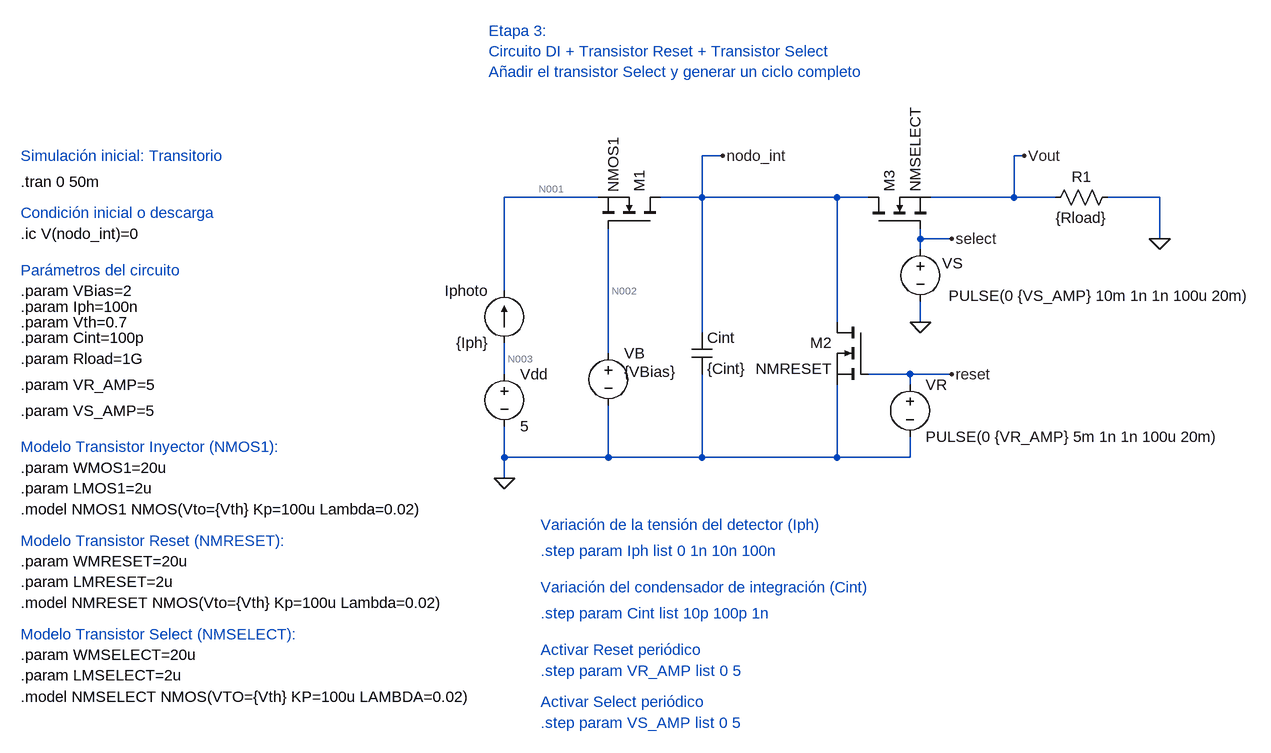
[diagram p0: schematic ID_Etapa3_Select_NMOS.asc]
ID_Etapa3_Select_NMOS.asc, the LTspice schematic file:
Version 4.1
SHEET 1 1592 1016
WIRE -96 0 -128 0
WIRE 368 0 352 0
WIRE -288 64 -432 64
WIRE -128 64 -128 0
WIRE -128 64 -192 64
WIRE 80 64 -128 64
WIRE 128 64 80 64
WIRE 352 64 352 0
WIRE 352 64 224 64
WIRE 416 64 352 64
WIRE 576 64 496 64
WIRE 208 128 208 112
WIRE 256 128 208 128
WIRE 576 128 576 64
WIRE 208 144 208 128
WIRE -432 208 -432 64
WIRE 80 256 80 64
WIRE 208 256 208 224
WIRE -128 272 -128 64
WIRE -272 304 -272 112
WIRE -432 336 -432 288
WIRE 192 336 128 336
WIRE 256 336 192 336
WIRE 192 352 192 336
WIRE -432 464 -432 416
WIRE -272 464 -272 384
WIRE -272 464 -432 464
WIRE -128 464 -128 336
WIRE -128 464 -272 464
WIRE 80 464 80 352
WIRE 80 464 -128 464
WIRE 192 464 192 432
WIRE 192 464 80 464
WIRE -432 496 -432 464
FLAG -96 0 nodo_int
FLAG -432 496 0
FLAG 256 336 reset
FLAG 368 0 Vout
FLAG 256 128 select
FLAG 576 128 0
FLAG 208 256 0
SYMBOL current -432 288 R180
WINDOW 0 24 80 Left 2
WINDOW 3 24 0 Left 2
SYMATTR InstName Iphoto
SYMATTR Value {Iph}
SYMBOL nmos -192 112 M270
SYMATTR InstName M1
SYMATTR Value NMOS1
SYMATTR SpiceLine W={WMOS1} L={LMOS1}
SYMBOL cap -144 272 R0
SYMATTR InstName Cint
SYMATTR Value {Cint}
SYMBOL voltage -272 288 R0
WINDOW 3 24 44 Left 2
SYMATTR Value {VBias}
SYMATTR InstName VB
SYMBOL voltage -432 320 R0
WINDOW 123 0 0 Left 0
WINDOW 39 0 0 Left 0
SYMATTR InstName Vdd
SYMATTR Value 5
SYMBOL voltage 192 336 R0
WINDOW 123 0 0 Left 0
WINDOW 39 0 0 Left 0
SYMATTR InstName VR
SYMATTR Value PULSE(0 {VR_AMP} 5m 1n 1n 100u 20m)
SYMBOL nmos 128 256 M0
SYMATTR InstName M2
SYMATTR Value NMRESET
SYMATTR SpiceLine W={WMRESET} L={LMRESET}
SYMBOL nmos 128 112 R270
SYMATTR InstName M3
SYMATTR Value NMSELECT
SYMATTR SpiceLine W={WMSELECT} L={LMSELECT}
SYMBOL voltage 208 128 R0
WINDOW 0 49 22 Top 2
WINDOW 3 276 103 Bottom 2
WINDOW 123 0 0 Left 0
WINDOW 39 0 0 Left 0
SYMATTR InstName VS
SYMATTR Value PULSE(0 {VS_AMP} 10m 1n 1n 100u 20m)
SYMBOL res 400 80 R270
WINDOW 0 32 56 VTop 2
WINDOW 3 0 56 VBottom 2
SYMATTR InstName R1
SYMATTR Value {Rload}
TEXT -456 -192 Left 2 ;Etapa 3: \nCircuito DI + Transistor Reset + Transistor Select\nAñadir el transistor Select y generar un ciclo completo
TEXT -1176 544 Left 2 !.model NMOS1 NMOS(Vto={Vth} Kp=100u Lambda=0.02)
TEXT -1176 480 Left 2 !.param WMOS1=20u\n.param LMOS1=2u
TEXT -1176 448 Left 2 ;Modelo Transistor Inyector (NMOS1):
TEXT -1176 0 Left 2 ;Simulación inicial: Transitorio
TEXT -1176 120 Left 2 !.ic V(nodo_int)=0
TEXT -1176 88 Left 2 ;Condición inicial o descarga
TEXT -1176 208 Left 2 !.param VBias=2
TEXT -1176 232 Left 2 !.param Iph=100n
TEXT -1176 256 Left 2 !.param Vth=0.7
TEXT -1176 176 Left 2 ;Parámetros del circuito
TEXT -376 568 Left 2 ;Variación de la tensión del detector (Iph)
TEXT -376 608 Left 2 ;.step param Iph list 0 1n 10n 100n
TEXT -1176 280 Left 2 !.param Cint=100p
TEXT -1176 40 Left 2 !.tran 0 50m
TEXT -1176 592 Left 2 ;Modelo Transistor Reset (NMRESET):
TEXT -1176 624 Left 2 !.param WMRESET=20u\n.param LMRESET=2u
TEXT -1176 688 Left 2 !.model NMRESET NMOS(Vto={Vth} Kp=100u Lambda=0.02)
TEXT -376 664 Left 2 ;Variación del condensador de integración (Cint)
TEXT -376 704 Left 2 ;.step param Cint list 10p 100p 1n
TEXT -1176 352 Left 2 !.param VR_AMP=5
TEXT -376 792 Left 2 ;.step param VR_AMP list 0 5
TEXT -376 760 Left 2 ;Activar Reset periódico
TEXT -1176 832 Left 2 !.model NMSELECT NMOS(VTO={Vth} KP=100u LAMBDA=0.02)
TEXT -1176 736 Left 2 ;Modelo Transistor Select (NMSELECT):
TEXT -1176 768 Left 2 !.param WMSELECT=20u\n.param LMSELECT=2u
TEXT -1176 312 Left 2 !.param Rload=1G
TEXT -1176 392 Left 2 !.param VS_AMP=5
TEXT -376 840 Left 2 ;Activar Select periódico
TEXT -376 872 Left 2 ;.step param VS_AMP list 0 5

The netlist it stands for:
* ID_Etapa3_Select_NMOS.asc
Iphoto N003 N001 {Iph}
M1 nodo_int N002 N001 N001 NMOS1 W={WMOS1} L={LMOS1}
Cint nodo_int 0 {Cint}
VB N002 0 {VBias}
Vdd N003 0 5
VR reset 0 PULSE(0 {VR_AMP} 5m 1n 1n 100u 20m)
M2 nodo_int reset 0 0 NMRESET W={WMRESET} L={LMRESET}
M3 nodo_int select Vout Vout NMSELECT W={WMSELECT} L={LMSELECT}
VS select 0 PULSE(0 {VS_AMP} 10m 1n 1n 100u 20m)
R1 Vout 0 {Rload}
.model NMOS NMOS
.model PMOS PMOS
.lib standard.mos
* Etapa 3:
* Circuito DI + Transistor Reset + Transistor Select
* Añadir el transistor Select y generar un ciclo completo
.model NMOS1 NMOS(Vto={Vth} Kp=100u Lambda=0.02)
.param WMOS1=20u
.param LMOS1=2u
* Modelo Transistor Inyector (NMOS1):
* Simulación inicial: Transitorio
.ic V(nodo_int)=0
* Condición inicial o descarga
.param VBias=2
.param Iph=100n
.param Vth=0.7
* Parámetros del circuito
* Variación de la tensión del detector (Iph)
* .step param Iph list 0 1n 10n 100n
.param Cint=100p
.tran 0 50m
* Modelo Transistor Reset (NMRESET):
.param WMRESET=20u
.param LMRESET=2u
.model NMRESET NMOS(Vto={Vth} Kp=100u Lambda=0.02)
* Variación del condensador de integración (Cint)
* .step param Cint list 10p 100p 1n
.param VR_AMP=5
* .step param VR_AMP list 0 5
* Activar Reset periódico
.model NMSELECT NMOS(VTO={Vth} KP=100u LAMBDA=0.02)
* Modelo Transistor Select (NMSELECT):
.param WMSELECT=20u
.param LMSELECT=2u
.param Rload=1G
.param VS_AMP=5
* Activar Select periódico
* .step param VS_AMP list 0 5
.backanno
.end

* Results of the author's LTspice run, read from the files saved beside the schematic
* Operating Point, zero values left out:
*   V(n001) = 76.93 µV
*   V(n002) = 2 V
*   V(n003) = 5 V
*   I(Iphoto) = 100 nA
*   I(Vdd) = -100 nA
*   Id(M1) = -100 nA
*   Is(M1) = 100 nA
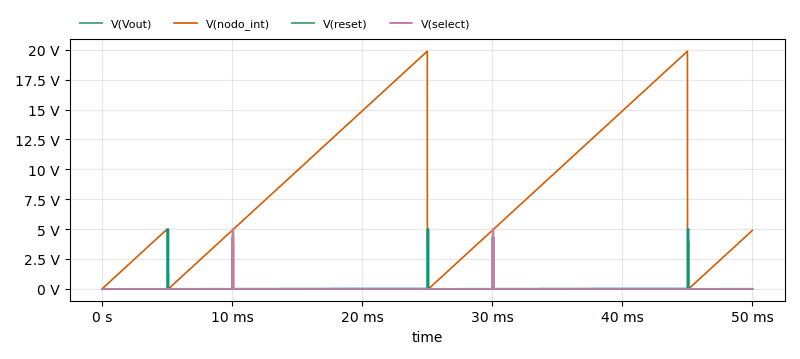
[diagram p1: Transient Analysis of ID_Etapa3_Select_NMOS.asc, plotted from the saved traces]
* Transient Analysis, 1 run:
*   V(Vout): min 0 V, max 4.296 V, average 33.92 mV, rms 272.3 mV, last 9.79 mV
*   V(nodo_int): min 0 V, max 19.89 V, average 8.406 V, rms 10.32 V, last 4.9 V
*   V(reset): min 0 V, max 5 V, average 30 mV, rms 387.3 mV, last 0 V
*   V(select): min 0 V, max 5 V, average 20 mV, rms 316.2 mV, last 0 V